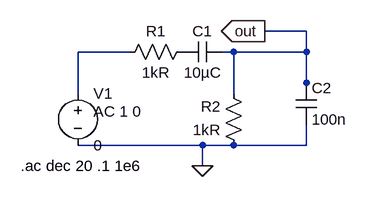
[diagram p0: schematic LTSchematic1.asc]
LTSchematic1.asc, the LTspice schematic file:
Version 4.1
SHEET 1 880 680
WIRE 320 -240 256 -240
WIRE 48 -208 -32 -208
WIRE 208 -208 192 -208
WIRE 320 -208 320 -240
WIRE 320 -208 208 -208
WIRE 320 -160 320 -208
WIRE -32 -144 -32 -208
WIRE 208 -144 208 -208
WIRE 320 -144 320 -160
WIRE 160 -64 -32 -64
WIRE 208 -64 160 -64
WIRE 320 -64 320 -96
WIRE 320 -64 208 -64
WIRE 160 -32 160 -64
FLAG 160 -32 0
FLAG 256 -240 out
IOPIN 256 -240 Out
SYMBOL voltage -32 -160 R0
WINDOW 123 24 44 Left 2
WINDOW 39 0 0 Left 0
SYMATTR Value2 AC 1 0
SYMATTR InstName V1
SYMATTR Value 0
SYMBOL res 144 -224 R90
WINDOW 0 0 56 VBottom 2
WINDOW 3 32 56 VTop 2
SYMATTR InstName R1
SYMATTR Value 1kR
SYMBOL cap 192 -224 R90
WINDOW 0 0 32 VBottom 2
WINDOW 3 32 32 VTop 2
SYMATTR InstName C1
SYMATTR Value 10µC
SYMBOL res 224 -48 R180
WINDOW 0 36 76 Left 2
WINDOW 3 36 40 Left 2
SYMATTR InstName R2
SYMATTR Value 1kR
SYMBOL cap 304 -160 R0
SYMATTR InstName C2
SYMATTR Value 100n
TEXT -120 -32 Left 2 !.ac dec 20 .1 1e6

The netlist it stands for:
* LTSchematic1.asc
V1 N001 0 0 AC 1 0
R1 P001 N001 1kR
C1 out P001 10µC
R2 0 out 1kR
C2 out 0 100n
.ac dec 20 .1 1e6
.backanno
.end

* Results of the author's LTspice run, read from the files saved beside the schematic
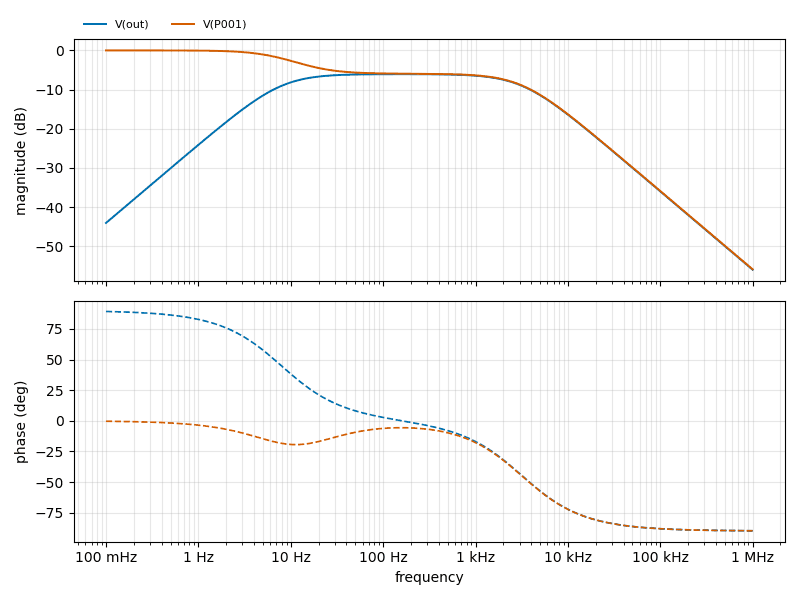
[diagram p1: AC Analysis of LTSchematic1.asc, plotted from the saved traces]
* AC Analysis, 1 run:
*   V(out): -44.04 dB at 100 mHz, -55.96 dB at 1 MHz, peak -6.06 dB at 158.5 Hz, 3 dB below the peak at 7.901 Hz and 3.205 kHz
*   V(P001): -0.00 dB at 100 mHz, -55.88 dB at 1 MHz, peak -0.00 dB at 100 mHz, 3 dB below the peak at 11.31 Hz